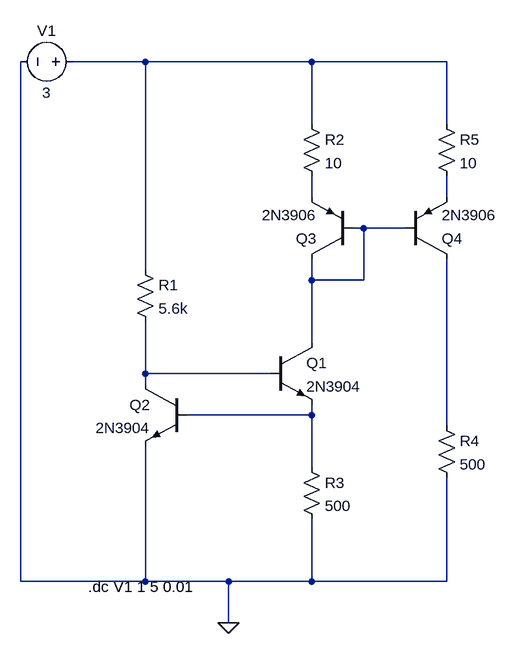
[diagram p0: schematic Source_Current.asc]
Source_Current.asc, the LTspice schematic file:
Version 4
SHEET 1 880 680
WIRE 48 -240 -64 -240
WIRE 304 -240 48 -240
WIRE 512 -240 304 -240
WIRE 304 -144 304 -240
WIRE 512 -144 512 -240
WIRE 304 -32 304 -64
WIRE 512 -32 512 -64
WIRE 384 16 368 16
WIRE 448 16 384 16
WIRE 48 80 48 -240
WIRE 304 96 304 64
WIRE 384 96 384 16
WIRE 384 96 304 96
WIRE 304 192 304 96
WIRE 48 240 48 160
WIRE 240 240 48 240
WIRE 48 256 48 240
WIRE 304 304 304 288
WIRE 304 304 112 304
WIRE 512 320 512 64
WIRE 304 384 304 304
WIRE -144 560 -144 -240
WIRE 48 560 48 352
WIRE 48 560 -144 560
WIRE 176 560 48 560
WIRE 304 560 304 464
WIRE 304 560 176 560
WIRE 512 560 512 400
WIRE 512 560 304 560
WIRE 176 624 176 560
FLAG 176 624 0
SYMBOL res 32 64 R0
SYMATTR InstName R1
SYMATTR Value 5.6k
SYMBOL res 288 -160 R0
SYMATTR InstName R2
SYMATTR Value 10
SYMBOL res 288 368 R0
SYMATTR InstName R3
SYMATTR Value 500
SYMBOL res 496 304 R0
SYMATTR InstName R4
SYMATTR Value 500
SYMBOL res 496 -160 R0
SYMATTR InstName R5
SYMATTR Value 10
SYMBOL npn 240 192 R0
SYMATTR InstName Q1
SYMATTR Value 2N3904
SYMBOL npn 112 256 M0
SYMATTR InstName Q2
SYMATTR Value 2N3904
SYMBOL pnp 368 64 R180
SYMATTR InstName Q3
SYMATTR Value 2N3906
SYMBOL pnp 448 64 M180
SYMATTR InstName Q4
SYMATTR Value 2N3906
SYMBOL voltage -48 -240 R90
WINDOW 0 -32 56 VBottom 2
WINDOW 3 32 56 VTop 2
WINDOW 123 0 0 Left 0
WINDOW 39 0 0 Left 0
SYMATTR InstName V1
SYMATTR Value 3
TEXT -40 568 Left 2 !.dc V1 1 5 0.01

The netlist it stands for:
* Source_Current.asc
R1 N001 N005 5.6k
R2 N001 N002 10
R3 N006 0 500
R4 N007 0 500
R5 N001 N003 10
Q1 N004 N005 N006 0 2N3904
Q2 N005 N006 0 0 2N3904
Q3 N004 N004 N002 0 2N3906
Q4 N007 N004 N003 0 2N3906
V1 N001 0 3
.model NPN NPN
.model PNP PNP
.lib standard.bjt
.dc V1 1 5 0.01
.backanno
.end